# EAGLE design domeBase (EAGLE 7.4.0)
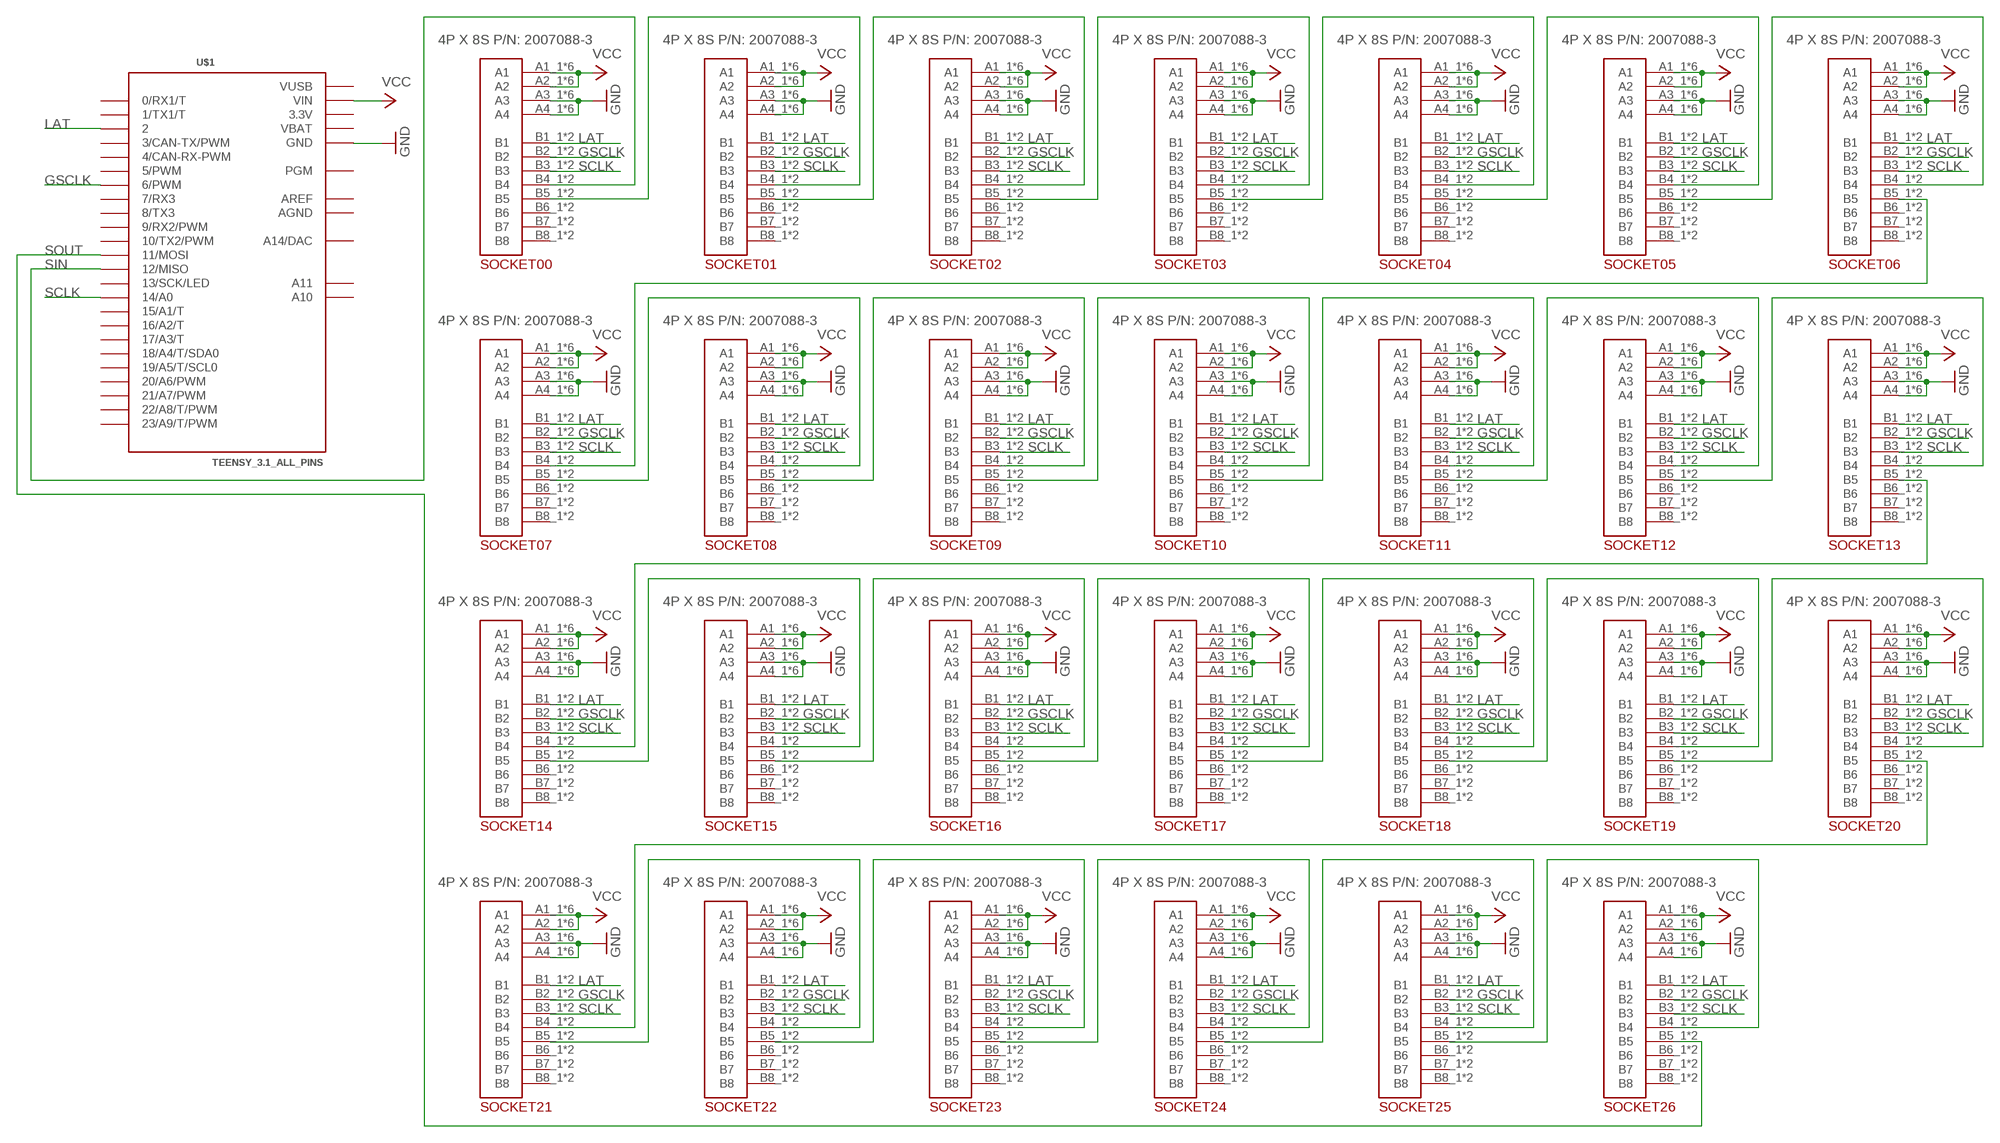
[diagram p0: schematic, sheet 1]

## Parts
SOCKET00  4POWER_8SIGNALMOUNTING_BOARD  [4POWER_8SIGNAL_MOUNT]
SOCKET01  4POWER_8SIGNALMOUNTING_BOARD  [4POWER_8SIGNAL_MOUNT]
SOCKET02  4POWER_8SIGNALMOUNTING_BOARD  [4POWER_8SIGNAL_MOUNT]
SOCKET03  4POWER_8SIGNALMOUNTING_BOARD  [4POWER_8SIGNAL_MOUNT]
SOCKET04  4POWER_8SIGNALMOUNTING_BOARD  [4POWER_8SIGNAL_MOUNT]
SOCKET05  4POWER_8SIGNALMOUNTING_BOARD  [4POWER_8SIGNAL_MOUNT]
SOCKET06  4POWER_8SIGNALMOUNTING_BOARD  [4POWER_8SIGNAL_MOUNT]
SOCKET07  4POWER_8SIGNALMOUNTING_BOARD  [4POWER_8SIGNAL_MOUNT]
SOCKET08  4POWER_8SIGNALMOUNTING_BOARD  [4POWER_8SIGNAL_MOUNT]
SOCKET09  4POWER_8SIGNALMOUNTING_BOARD  [4POWER_8SIGNAL_MOUNT]
SOCKET10  4POWER_8SIGNALMOUNTING_BOARD  [4POWER_8SIGNAL_MOUNT]
SOCKET11  4POWER_8SIGNALMOUNTING_BOARD  [4POWER_8SIGNAL_MOUNT]
SOCKET12  4POWER_8SIGNALMOUNTING_BOARD  [4POWER_8SIGNAL_MOUNT]
SOCKET13  4POWER_8SIGNALMOUNTING_BOARD  [4POWER_8SIGNAL_MOUNT]
SOCKET14  4POWER_8SIGNALMOUNTING_BOARD  [4POWER_8SIGNAL_MOUNT]
SOCKET15  4POWER_8SIGNALMOUNTING_BOARD  [4POWER_8SIGNAL_MOUNT]
SOCKET16  4POWER_8SIGNALMOUNTING_BOARD  [4POWER_8SIGNAL_MOUNT]
SOCKET17  4POWER_8SIGNALMOUNTING_BOARD  [4POWER_8SIGNAL_MOUNT]
SOCKET18  4POWER_8SIGNALMOUNTING_BOARD  [4POWER_8SIGNAL_MOUNT]
SOCKET19  4POWER_8SIGNALMOUNTING_BOARD  [4POWER_8SIGNAL_MOUNT]
SOCKET20  4POWER_8SIGNALMOUNTING_BOARD  [4POWER_8SIGNAL_MOUNT]
SOCKET21  4POWER_8SIGNALMOUNTING_BOARD  [4POWER_8SIGNAL_MOUNT]
SOCKET22  4POWER_8SIGNALMOUNTING_BOARD  [4POWER_8SIGNAL_MOUNT]
SOCKET23  4POWER_8SIGNALMOUNTING_BOARD  [4POWER_8SIGNAL_MOUNT]
SOCKET24  4POWER_8SIGNALMOUNTING_BOARD  [4POWER_8SIGNAL_MOUNT]
SOCKET25  4POWER_8SIGNALMOUNTING_BOARD  [4POWER_8SIGNAL_MOUNT]
SOCKET26  4POWER_8SIGNALMOUNTING_BOARD  [4POWER_8SIGNAL_MOUNT]
U$1  TEENSY_3.1_ALL_PINS  [TEENSY3-ALL_PINS]

## Nets
GND: SOCKET00.A3_1(A3) SOCKET00.A3_2(A3) SOCKET00.A3_3(A3) SOCKET00.A3_4(A3) SOCKET00.A3_5(A3) SOCKET00.A3_6(A3) SOCKET00.A4_1(A4) SOCKET00.A4_2(A4) SOCKET00.A4_3(A4) SOCKET00.A4_4(A4) SOCKET00.A4_5(A4) SOCKET00.A4_6(A4) SOCKET01.A3_1(A3) SOCKET01.A3_2(A3) SOCKET01.A3_3(A3) SOCKET01.A3_4(A3) SOCKET01.A3_5(A3) SOCKET01.A3_6(A3) SOCKET01.A4_1(A4) SOCKET01.A4_2(A4) SOCKET01.A4_3(A4) SOCKET01.A4_4(A4) SOCKET01.A4_5(A4) SOCKET01.A4_6(A4) SOCKET02.A3_1(A3) SOCKET02.A3_2(A3) SOCKET02.A3_3(A3) SOCKET02.A3_4(A3) SOCKET02.A3_5(A3) SOCKET02.A3_6(A3) SOCKET02.A4_1(A4) SOCKET02.A4_2(A4) SOCKET02.A4_3(A4) SOCKET02.A4_4(A4) SOCKET02.A4_5(A4) SOCKET02.A4_6(A4) SOCKET03.A3_1(A3) SOCKET03.A3_2(A3) SOCKET03.A3_3(A3) SOCKET03.A3_4(A3) SOCKET03.A3_5(A3) SOCKET03.A3_6(A3) SOCKET03.A4_1(A4) SOCKET03.A4_2(A4) SOCKET03.A4_3(A4) SOCKET03.A4_4(A4) SOCKET03.A4_5(A4) SOCKET03.A4_6(A4) SOCKET04.A3_1(A3) SOCKET04.A3_2(A3) SOCKET04.A3_3(A3) SOCKET04.A3_4(A3) SOCKET04.A3_5(A3) SOCKET04.A3_6(A3) SOCKET04.A4_1(A4) SOCKET04.A4_2(A4) SOCKET04.A4_3(A4) SOCKET04.A4_4(A4) SOCKET04.A4_5(A4) SOCKET04.A4_6(A4) SOCKET05.A3_1(A3) SOCKET05.A3_2(A3) SOCKET05.A3_3(A3) SOCKET05.A3_4(A3) SOCKET05.A3_5(A3) SOCKET05.A3_6(A3) SOCKET05.A4_1(A4) SOCKET05.A4_2(A4) SOCKET05.A4_3(A4) SOCKET05.A4_4(A4) SOCKET05.A4_5(A4) SOCKET05.A4_6(A4) SOCKET06.A3_1(A3) SOCKET06.A3_2(A3) SOCKET06.A3_3(A3) SOCKET06.A3_4(A3) SOCKET06.A3_5(A3) SOCKET06.A3_6(A3) SOCKET06.A4_1(A4) SOCKET06.A4_2(A4) SOCKET06.A4_3(A4) SOCKET06.A4_4(A4) SOCKET06.A4_5(A4) SOCKET06.A4_6(A4) SOCKET07.A3_1(A3) SOCKET07.A3_2(A3) SOCKET07.A3_3(A3) SOCKET07.A3_4(A3) SOCKET07.A3_5(A3) SOCKET07.A3_6(A3) SOCKET07.A4_1(A4) SOCKET07.A4_2(A4) SOCKET07.A4_3(A4) SOCKET07.A4_4(A4) SOCKET07.A4_5(A4) SOCKET07.A4_6(A4) SOCKET08.A3_1(A3) SOCKET08.A3_2(A3) SOCKET08.A3_3(A3) SOCKET08.A3_4(A3) SOCKET08.A3_5(A3) SOCKET08.A3_6(A3) SOCKET08.A4_1(A4) SOCKET08.A4_2(A4) SOCKET08.A4_3(A4) SOCKET08.A4_4(A4) SOCKET08.A4_5(A4) SOCKET08.A4_6(A4) SOCKET09.A3_1(A3) SOCKET09.A3_2(A3) SOCKET09.A3_3(A3) SOCKET09.A3_4(A3) SOCKET09.A3_5(A3) SOCKET09.A3_6(A3) SOCKET09.A4_1(A4) SOCKET09.A4_2(A4) SOCKET09.A4_3(A4) SOCKET09.A4_4(A4) SOCKET09.A4_5(A4) SOCKET09.A4_6(A4) SOCKET10.A3_1(A3) SOCKET10.A3_2(A3) SOCKET10.A3_3(A3) SOCKET10.A3_4(A3) SOCKET10.A3_5(A3) SOCKET10.A3_6(A3) SOCKET10.A4_1(A4) SOCKET10.A4_2(A4) SOCKET10.A4_3(A4) SOCKET10.A4_4(A4) SOCKET10.A4_5(A4) SOCKET10.A4_6(A4) SOCKET11.A3_1(A3) SOCKET11.A3_2(A3) SOCKET11.A3_3(A3) SOCKET11.A3_4(A3) SOCKET11.A3_5(A3) SOCKET11.A3_6(A3) SOCKET11.A4_1(A4) SOCKET11.A4_2(A4) SOCKET11.A4_3(A4) SOCKET11.A4_4(A4) SOCKET11.A4_5(A4) SOCKET11.A4_6(A4) SOCKET12.A3_1(A3) SOCKET12.A3_2(A3) SOCKET12.A3_3(A3) SOCKET12.A3_4(A3) SOCKET12.A3_5(A3) SOCKET12.A3_6(A3) SOCKET12.A4_1(A4) SOCKET12.A4_2(A4) SOCKET12.A4_3(A4) SOCKET12.A4_4(A4) SOCKET12.A4_5(A4) SOCKET12.A4_6(A4) SOCKET13.A3_1(A3) SOCKET13.A3_2(A3) SOCKET13.A3_3(A3) SOCKET13.A3_4(A3) SOCKET13.A3_5(A3) SOCKET13.A3_6(A3) SOCKET13.A4_1(A4) SOCKET13.A4_2(A4) SOCKET13.A4_3(A4) SOCKET13.A4_4(A4) SOCKET13.A4_5(A4) SOCKET13.A4_6(A4) SOCKET14.A3_1(A3) SOCKET14.A3_2(A3) SOCKET14.A3_3(A3) SOCKET14.A3_4(A3) SOCKET14.A3_5(A3) SOCKET14.A3_6(A3) SOCKET14.A4_1(A4) SOCKET14.A4_2(A4) SOCKET14.A4_3(A4) SOCKET14.A4_4(A4) SOCKET14.A4_5(A4) SOCKET14.A4_6(A4) SOCKET15.A3_1(A3) SOCKET15.A3_2(A3) SOCKET15.A3_3(A3) SOCKET15.A3_4(A3) SOCKET15.A3_5(A3) SOCKET15.A3_6(A3) SOCKET15.A4_1(A4) SOCKET15.A4_2(A4) SOCKET15.A4_3(A4) SOCKET15.A4_4(A4) SOCKET15.A4_5(A4) SOCKET15.A4_6(A4) SOCKET16.A3_1(A3) SOCKET16.A3_2(A3) SOCKET16.A3_3(A3) SOCKET16.A3_4(A3) SOCKET16.A3_5(A3) SOCKET16.A3_6(A3) SOCKET16.A4_1(A4) SOCKET16.A4_2(A4) SOCKET16.A4_3(A4) SOCKET16.A4_4(A4) SOCKET16.A4_5(A4) SOCKET16.A4_6(A4) SOCKET17.A3_1(A3) SOCKET17.A3_2(A3) SOCKET17.A3_3(A3) SOCKET17.A3_4(A3) SOCKET17.A3_5(A3) SOCKET17.A3_6(A3) SOCKET17.A4_1(A4) SOCKET17.A4_2(A4) SOCKET17.A4_3(A4) SOCKET17.A4_4(A4) SOCKET17.A4_5(A4) SOCKET17.A4_6(A4) SOCKET18.A3_1(A3) SOCKET18.A3_2(A3) SOCKET18.A3_3(A3) SOCKET18.A3_4(A3) SOCKET18.A3_5(A3) SOCKET18.A3_6(A3) SOCKET18.A4_1(A4) SOCKET18.A4_2(A4) SOCKET18.A4_3(A4) SOCKET18.A4_4(A4) SOCKET18.A4_5(A4) SOCKET18.A4_6(A4) SOCKET19.A3_1(A3) SOCKET19.A3_2(A3) SOCKET19.A3_3(A3) SOCKET19.A3_4(A3) SOCKET19.A3_5(A3) SOCKET19.A3_6(A3) SOCKET19.A4_1(A4) SOCKET19.A4_2(A4) SOCKET19.A4_3(A4) SOCKET19.A4_4(A4) SOCKET19.A4_5(A4) SOCKET19.A4_6(A4) SOCKET20.A3_1(A3) SOCKET20.A3_2(A3) SOCKET20.A3_3(A3) SOCKET20.A3_4(A3) SOCKET20.A3_5(A3) SOCKET20.A3_6(A3) SOCKET20.A4_1(A4) SOCKET20.A4_2(A4) SOCKET20.A4_3(A4) SOCKET20.A4_4(A4) SOCKET20.A4_5(A4) SOCKET20.A4_6(A4) SOCKET21.A3_1(A3) SOCKET21.A3_2(A3) SOCKET21.A3_3(A3) SOCKET21.A3_4(A3) SOCKET21.A3_5(A3) SOCKET21.A3_6(A3) SOCKET21.A4_1(A4) SOCKET21.A4_2(A4) SOCKET21.A4_3(A4) SOCKET21.A4_4(A4) SOCKET21.A4_5(A4) SOCKET21.A4_6(A4) SOCKET22.A3_1(A3) SOCKET22.A3_2(A3) SOCKET22.A3_3(A3) SOCKET22.A3_4(A3) SOCKET22.A3_5(A3) SOCKET22.A3_6(A3) SOCKET22.A4_1(A4) SOCKET22.A4_2(A4) SOCKET22.A4_3(A4) SOCKET22.A4_4(A4) SOCKET22.A4_5(A4) SOCKET22.A4_6(A4) SOCKET23.A3_1(A3) SOCKET23.A3_2(A3) SOCKET23.A3_3(A3) SOCKET23.A3_4(A3) SOCKET23.A3_5(A3) SOCKET23.A3_6(A3) SOCKET23.A4_1(A4) SOCKET23.A4_2(A4) SOCKET23.A4_3(A4) SOCKET23.A4_4(A4) SOCKET23.A4_5(A4) SOCKET23.A4_6(A4) SOCKET24.A3_1(A3) SOCKET24.A3_2(A3) SOCKET24.A3_3(A3) SOCKET24.A3_4(A3) SOCKET24.A3_5(A3) SOCKET24.A3_6(A3) SOCKET24.A4_1(A4) SOCKET24.A4_2(A4) SOCKET24.A4_3(A4) SOCKET24.A4_4(A4) SOCKET24.A4_5(A4) SOCKET24.A4_6(A4) SOCKET25.A3_1(A3) SOCKET25.A3_2(A3) SOCKET25.A3_3(A3) SOCKET25.A3_4(A3) SOCKET25.A3_5(A3) SOCKET25.A3_6(A3) SOCKET25.A4_1(A4) SOCKET25.A4_2(A4) SOCKET25.A4_3(A4) SOCKET25.A4_4(A4) SOCKET25.A4_5(A4) SOCKET25.A4_6(A4) SOCKET26.A3_1(A3) SOCKET26.A3_2(A3) SOCKET26.A3_3(A3) SOCKET26.A3_4(A3) SOCKET26.A3_5(A3) SOCKET26.A3_6(A3) SOCKET26.A4_1(A4) SOCKET26.A4_2(A4) SOCKET26.A4_3(A4) SOCKET26.A4_4(A4) SOCKET26.A4_5(A4) SOCKET26.A4_6(A4) U$1.GND U$1.GND1(GND)
GSCLK: SOCKET00.B2_1(B2) SOCKET00.B2_2(B2) SOCKET01.B2_1(B2) SOCKET01.B2_2(B2) SOCKET02.B2_1(B2) SOCKET02.B2_2(B2) SOCKET03.B2_1(B2) SOCKET03.B2_2(B2) SOCKET04.B2_1(B2) SOCKET04.B2_2(B2) SOCKET05.B2_1(B2) SOCKET05.B2_2(B2) SOCKET06.B2_1(B2) SOCKET06.B2_2(B2) SOCKET07.B2_1(B2) SOCKET07.B2_2(B2) SOCKET08.B2_1(B2) SOCKET08.B2_2(B2) SOCKET09.B2_1(B2) SOCKET09.B2_2(B2) SOCKET10.B2_1(B2) SOCKET10.B2_2(B2) SOCKET11.B2_1(B2) SOCKET11.B2_2(B2) SOCKET12.B2_1(B2) SOCKET12.B2_2(B2) SOCKET13.B2_1(B2) SOCKET13.B2_2(B2) SOCKET14.B2_1(B2) SOCKET14.B2_2(B2) SOCKET15.B2_1(B2) SOCKET15.B2_2(B2) SOCKET16.B2_1(B2) SOCKET16.B2_2(B2) SOCKET17.B2_1(B2) SOCKET17.B2_2(B2) SOCKET18.B2_1(B2) SOCKET18.B2_2(B2) SOCKET19.B2_1(B2) SOCKET19.B2_2(B2) SOCKET20.B2_1(B2) SOCKET20.B2_2(B2) SOCKET21.B2_1(B2) SOCKET21.B2_2(B2) SOCKET22.B2_1(B2) SOCKET22.B2_2(B2) SOCKET23.B2_1(B2) SOCKET23.B2_2(B2) SOCKET24.B2_1(B2) SOCKET24.B2_2(B2) SOCKET25.B2_1(B2) SOCKET25.B2_2(B2) SOCKET26.B2_1(B2) SOCKET26.B2_2(B2) U$1.6(6/PWM)
LAT: SOCKET00.B1_1(B1) SOCKET00.B1_2(B1) SOCKET01.B1_1(B1) SOCKET01.B1_2(B1) SOCKET02.B1_1(B1) SOCKET02.B1_2(B1) SOCKET03.B1_1(B1) SOCKET03.B1_2(B1) SOCKET04.B1_1(B1) SOCKET04.B1_2(B1) SOCKET05.B1_1(B1) SOCKET05.B1_2(B1) SOCKET06.B1_1(B1) SOCKET06.B1_2(B1) SOCKET07.B1_1(B1) SOCKET07.B1_2(B1) SOCKET08.B1_1(B1) SOCKET08.B1_2(B1) SOCKET09.B1_1(B1) SOCKET09.B1_2(B1) SOCKET10.B1_1(B1) SOCKET10.B1_2(B1) SOCKET11.B1_1(B1) SOCKET11.B1_2(B1) SOCKET12.B1_1(B1) SOCKET12.B1_2(B1) SOCKET13.B1_1(B1) SOCKET13.B1_2(B1) SOCKET14.B1_1(B1) SOCKET14.B1_2(B1) SOCKET15.B1_1(B1) SOCKET15.B1_2(B1) SOCKET16.B1_1(B1) SOCKET16.B1_2(B1) SOCKET17.B1_1(B1) SOCKET17.B1_2(B1) SOCKET18.B1_1(B1) SOCKET18.B1_2(B1) SOCKET19.B1_1(B1) SOCKET19.B1_2(B1) SOCKET20.B1_1(B1) SOCKET20.B1_2(B1) SOCKET21.B1_1(B1) SOCKET21.B1_2(B1) SOCKET22.B1_1(B1) SOCKET22.B1_2(B1) SOCKET23.B1_1(B1) SOCKET23.B1_2(B1) SOCKET24.B1_1(B1) SOCKET24.B1_2(B1) SOCKET25.B1_1(B1) SOCKET25.B1_2(B1) SOCKET26.B1_1(B1) SOCKET26.B1_2(B1) U$1.2
N$1: SOCKET00.B5_1(B5) SOCKET00.B5_2(B5) SOCKET01.B4_1(B4) SOCKET01.B4_2(B4)
N$2: SOCKET01.B5_1(B5) SOCKET01.B5_2(B5) SOCKET02.B4_1(B4) SOCKET02.B4_2(B4)
N$3: SOCKET02.B5_1(B5) SOCKET02.B5_2(B5) SOCKET03.B4_1(B4) SOCKET03.B4_2(B4)
N$4: SOCKET03.B5_1(B5) SOCKET03.B5_2(B5) SOCKET04.B4_1(B4) SOCKET04.B4_2(B4)
N$5: SOCKET04.B5_1(B5) SOCKET04.B5_2(B5) SOCKET05.B4_1(B4) SOCKET05.B4_2(B4)
N$6: SOCKET05.B5_1(B5) SOCKET05.B5_2(B5) SOCKET06.B4_1(B4) SOCKET06.B4_2(B4)
N$7: SOCKET06.B5_1(B5) SOCKET06.B5_2(B5) SOCKET07.B4_1(B4) SOCKET07.B4_2(B4)
N$8: SOCKET07.B5_1(B5) SOCKET07.B5_2(B5) SOCKET08.B4_1(B4) SOCKET08.B4_2(B4)
N$9: SOCKET08.B5_1(B5) SOCKET08.B5_2(B5) SOCKET09.B4_1(B4) SOCKET09.B4_2(B4)
N$10: SOCKET09.B5_1(B5) SOCKET09.B5_2(B5) SOCKET10.B4_1(B4) SOCKET10.B4_2(B4)
N$11: SOCKET10.B5_1(B5) SOCKET10.B5_2(B5) SOCKET11.B4_1(B4) SOCKET11.B4_2(B4)
N$12: SOCKET11.B5_1(B5) SOCKET11.B5_2(B5) SOCKET12.B4_1(B4) SOCKET12.B4_2(B4)
N$13: SOCKET12.B5_1(B5) SOCKET12.B5_2(B5) SOCKET13.B4_1(B4) SOCKET13.B4_2(B4)
N$14: SOCKET13.B5_1(B5) SOCKET13.B5_2(B5) SOCKET14.B4_1(B4) SOCKET14.B4_2(B4)
N$15: SOCKET14.B5_1(B5) SOCKET14.B5_2(B5) SOCKET15.B4_1(B4) SOCKET15.B4_2(B4)
N$16: SOCKET15.B5_1(B5) SOCKET15.B5_2(B5) SOCKET16.B4_1(B4) SOCKET16.B4_2(B4)
N$17: SOCKET16.B5_1(B5) SOCKET16.B5_2(B5) SOCKET17.B4_1(B4) SOCKET17.B4_2(B4)
N$18: SOCKET17.B5_1(B5) SOCKET17.B5_2(B5) SOCKET18.B4_1(B4) SOCKET18.B4_2(B4)
N$19: SOCKET18.B5_1(B5) SOCKET18.B5_2(B5) SOCKET19.B4_1(B4) SOCKET19.B4_2(B4)
N$20: SOCKET19.B5_1(B5) SOCKET19.B5_2(B5) SOCKET20.B4_1(B4) SOCKET20.B4_2(B4)
N$21: SOCKET20.B5_1(B5) SOCKET20.B5_2(B5) SOCKET21.B4_1(B4) SOCKET21.B4_2(B4)
N$22: SOCKET21.B5_1(B5) SOCKET21.B5_2(B5) SOCKET22.B4_1(B4) SOCKET22.B4_2(B4)
N$23: SOCKET22.B5_1(B5) SOCKET22.B5_2(B5) SOCKET23.B4_1(B4) SOCKET23.B4_2(B4)
N$24: SOCKET23.B5_1(B5) SOCKET23.B5_2(B5) SOCKET24.B4_1(B4) SOCKET24.B4_2(B4)
N$25: SOCKET24.B5_1(B5) SOCKET24.B5_2(B5) SOCKET25.B4_1(B4) SOCKET25.B4_2(B4)
N$26: SOCKET25.B5_1(B5) SOCKET25.B5_2(B5) SOCKET26.B4_1(B4) SOCKET26.B4_2(B4)
SCLK: SOCKET00.B3_1(B3) SOCKET00.B3_2(B3) SOCKET01.B3_1(B3) SOCKET01.B3_2(B3) SOCKET02.B3_1(B3) SOCKET02.B3_2(B3) SOCKET03.B3_1(B3) SOCKET03.B3_2(B3) SOCKET04.B3_1(B3) SOCKET04.B3_2(B3) SOCKET05.B3_1(B3) SOCKET05.B3_2(B3) SOCKET06.B3_1(B3) SOCKET06.B3_2(B3) SOCKET07.B3_1(B3) SOCKET07.B3_2(B3) SOCKET08.B3_1(B3) SOCKET08.B3_2(B3) SOCKET09.B3_1(B3) SOCKET09.B3_2(B3) SOCKET10.B3_1(B3) SOCKET10.B3_2(B3) SOCKET11.B3_1(B3) SOCKET11.B3_2(B3) SOCKET12.B3_1(B3) SOCKET12.B3_2(B3) SOCKET13.B3_1(B3) SOCKET13.B3_2(B3) SOCKET14.B3_1(B3) SOCKET14.B3_2(B3) SOCKET15.B3_1(B3) SOCKET15.B3_2(B3) SOCKET16.B3_1(B3) SOCKET16.B3_2(B3) SOCKET17.B3_1(B3) SOCKET17.B3_2(B3) SOCKET18.B3_1(B3) SOCKET18.B3_2(B3) SOCKET19.B3_1(B3) SOCKET19.B3_2(B3) SOCKET20.B3_1(B3) SOCKET20.B3_2(B3) SOCKET21.B3_1(B3) SOCKET21.B3_2(B3) SOCKET22.B3_1(B3) SOCKET22.B3_2(B3) SOCKET23.B3_1(B3) SOCKET23.B3_2(B3) SOCKET24.B3_1(B3) SOCKET24.B3_2(B3) SOCKET25.B3_1(B3) SOCKET25.B3_2(B3) SOCKET26.B3_1(B3) SOCKET26.B3_2(B3) U$1.14/A0
SIN: SOCKET00.B4_1(B4) SOCKET00.B4_2(B4) U$1.12(12/MISO)
SOUT: SOCKET26.B5_1(B5) SOCKET26.B5_2(B5) U$1.11(11/MOSI)
VCC: SOCKET00.A1_1(A1) SOCKET00.A1_2(A1) SOCKET00.A1_3(A1) SOCKET00.A1_4(A1) SOCKET00.A1_5(A1) SOCKET00.A1_6(A1) SOCKET00.A2_1(A2) SOCKET00.A2_2(A2) SOCKET00.A2_3(A2) SOCKET00.A2_4(A2) SOCKET00.A2_5(A2) SOCKET00.A2_6(A2) SOCKET01.A1_1(A1) SOCKET01.A1_2(A1) SOCKET01.A1_3(A1) SOCKET01.A1_4(A1) SOCKET01.A1_5(A1) SOCKET01.A1_6(A1) SOCKET01.A2_1(A2) SOCKET01.A2_2(A2) SOCKET01.A2_3(A2) SOCKET01.A2_4(A2) SOCKET01.A2_5(A2) SOCKET01.A2_6(A2) SOCKET02.A1_1(A1) SOCKET02.A1_2(A1) SOCKET02.A1_3(A1) SOCKET02.A1_4(A1) SOCKET02.A1_5(A1) SOCKET02.A1_6(A1) SOCKET02.A2_1(A2) SOCKET02.A2_2(A2) SOCKET02.A2_3(A2) SOCKET02.A2_4(A2) SOCKET02.A2_5(A2) SOCKET02.A2_6(A2) SOCKET03.A1_1(A1) SOCKET03.A1_2(A1) SOCKET03.A1_3(A1) SOCKET03.A1_4(A1) SOCKET03.A1_5(A1) SOCKET03.A1_6(A1) SOCKET03.A2_1(A2) SOCKET03.A2_2(A2) SOCKET03.A2_3(A2) SOCKET03.A2_4(A2) SOCKET03.A2_5(A2) SOCKET03.A2_6(A2) SOCKET04.A1_1(A1) SOCKET04.A1_2(A1) SOCKET04.A1_3(A1) SOCKET04.A1_4(A1) SOCKET04.A1_5(A1) SOCKET04.A1_6(A1) SOCKET04.A2_1(A2) SOCKET04.A2_2(A2) SOCKET04.A2_3(A2) SOCKET04.A2_4(A2) SOCKET04.A2_5(A2) SOCKET04.A2_6(A2) SOCKET05.A1_1(A1) SOCKET05.A1_2(A1) SOCKET05.A1_3(A1) SOCKET05.A1_4(A1) SOCKET05.A1_5(A1) SOCKET05.A1_6(A1) SOCKET05.A2_1(A2) SOCKET05.A2_2(A2) SOCKET05.A2_3(A2) SOCKET05.A2_4(A2) SOCKET05.A2_5(A2) SOCKET05.A2_6(A2) SOCKET06.A1_1(A1) SOCKET06.A1_2(A1) SOCKET06.A1_3(A1) SOCKET06.A1_4(A1) SOCKET06.A1_5(A1) SOCKET06.A1_6(A1) SOCKET06.A2_1(A2) SOCKET06.A2_2(A2) SOCKET06.A2_3(A2) SOCKET06.A2_4(A2) SOCKET06.A2_5(A2) SOCKET06.A2_6(A2) SOCKET07.A1_1(A1) SOCKET07.A1_2(A1) SOCKET07.A1_3(A1) SOCKET07.A1_4(A1) SOCKET07.A1_5(A1) SOCKET07.A1_6(A1) SOCKET07.A2_1(A2) SOCKET07.A2_2(A2) SOCKET07.A2_3(A2) SOCKET07.A2_4(A2) SOCKET07.A2_5(A2) SOCKET07.A2_6(A2) SOCKET08.A1_1(A1) SOCKET08.A1_2(A1) SOCKET08.A1_3(A1) SOCKET08.A1_4(A1) SOCKET08.A1_5(A1) SOCKET08.A1_6(A1) SOCKET08.A2_1(A2) SOCKET08.A2_2(A2) SOCKET08.A2_3(A2) SOCKET08.A2_4(A2) SOCKET08.A2_5(A2) SOCKET08.A2_6(A2) SOCKET09.A1_1(A1) SOCKET09.A1_2(A1) SOCKET09.A1_3(A1) SOCKET09.A1_4(A1) SOCKET09.A1_5(A1) SOCKET09.A1_6(A1) SOCKET09.A2_1(A2) SOCKET09.A2_2(A2) SOCKET09.A2_3(A2) SOCKET09.A2_4(A2) SOCKET09.A2_5(A2) SOCKET09.A2_6(A2) SOCKET10.A1_1(A1) SOCKET10.A1_2(A1) SOCKET10.A1_3(A1) SOCKET10.A1_4(A1) SOCKET10.A1_5(A1) SOCKET10.A1_6(A1) SOCKET10.A2_1(A2) SOCKET10.A2_2(A2) SOCKET10.A2_3(A2) SOCKET10.A2_4(A2) SOCKET10.A2_5(A2) SOCKET10.A2_6(A2) SOCKET11.A1_1(A1) SOCKET11.A1_2(A1) SOCKET11.A1_3(A1) SOCKET11.A1_4(A1) SOCKET11.A1_5(A1) SOCKET11.A1_6(A1) SOCKET11.A2_1(A2) SOCKET11.A2_2(A2) SOCKET11.A2_3(A2) SOCKET11.A2_4(A2) SOCKET11.A2_5(A2) SOCKET11.A2_6(A2) SOCKET12.A1_1(A1) SOCKET12.A1_2(A1) SOCKET12.A1_3(A1) SOCKET12.A1_4(A1) SOCKET12.A1_5(A1) SOCKET12.A1_6(A1) SOCKET12.A2_1(A2) SOCKET12.A2_2(A2) SOCKET12.A2_3(A2) SOCKET12.A2_4(A2) SOCKET12.A2_5(A2) SOCKET12.A2_6(A2) SOCKET13.A1_1(A1) SOCKET13.A1_2(A1) SOCKET13.A1_3(A1) SOCKET13.A1_4(A1) SOCKET13.A1_5(A1) SOCKET13.A1_6(A1) SOCKET13.A2_1(A2) SOCKET13.A2_2(A2) SOCKET13.A2_3(A2) SOCKET13.A2_4(A2) SOCKET13.A2_5(A2) SOCKET13.A2_6(A2) SOCKET14.A1_1(A1) SOCKET14.A1_2(A1) SOCKET14.A1_3(A1) SOCKET14.A1_4(A1) SOCKET14.A1_5(A1) SOCKET14.A1_6(A1) SOCKET14.A2_1(A2) SOCKET14.A2_2(A2) SOCKET14.A2_3(A2) SOCKET14.A2_4(A2) SOCKET14.A2_5(A2) SOCKET14.A2_6(A2) SOCKET15.A1_1(A1) SOCKET15.A1_2(A1) SOCKET15.A1_3(A1) SOCKET15.A1_4(A1) SOCKET15.A1_5(A1) SOCKET15.A1_6(A1) SOCKET15.A2_1(A2) SOCKET15.A2_2(A2) SOCKET15.A2_3(A2) SOCKET15.A2_4(A2) SOCKET15.A2_5(A2) SOCKET15.A2_6(A2) SOCKET16.A1_1(A1) SOCKET16.A1_2(A1) SOCKET16.A1_3(A1) SOCKET16.A1_4(A1) SOCKET16.A1_5(A1) SOCKET16.A1_6(A1) SOCKET16.A2_1(A2) SOCKET16.A2_2(A2) SOCKET16.A2_3(A2) SOCKET16.A2_4(A2) SOCKET16.A2_5(A2) SOCKET16.A2_6(A2) SOCKET17.A1_1(A1) SOCKET17.A1_2(A1) SOCKET17.A1_3(A1) SOCKET17.A1_4(A1) SOCKET17.A1_5(A1) SOCKET17.A1_6(A1) SOCKET17.A2_1(A2) SOCKET17.A2_2(A2) SOCKET17.A2_3(A2) SOCKET17.A2_4(A2) SOCKET17.A2_5(A2) SOCKET17.A2_6(A2) SOCKET18.A1_1(A1) SOCKET18.A1_2(A1) SOCKET18.A1_3(A1) SOCKET18.A1_4(A1) SOCKET18.A1_5(A1) SOCKET18.A1_6(A1) SOCKET18.A2_1(A2) SOCKET18.A2_2(A2) SOCKET18.A2_3(A2) SOCKET18.A2_4(A2) SOCKET18.A2_5(A2) SOCKET18.A2_6(A2) SOCKET19.A1_1(A1) SOCKET19.A1_2(A1) SOCKET19.A1_3(A1) SOCKET19.A1_4(A1) SOCKET19.A1_5(A1) SOCKET19.A1_6(A1) SOCKET19.A2_1(A2) SOCKET19.A2_2(A2) SOCKET19.A2_3(A2) SOCKET19.A2_4(A2) SOCKET19.A2_5(A2) SOCKET19.A2_6(A2) SOCKET20.A1_1(A1) SOCKET20.A1_2(A1) SOCKET20.A1_3(A1) SOCKET20.A1_4(A1) SOCKET20.A1_5(A1) SOCKET20.A1_6(A1) SOCKET20.A2_1(A2) SOCKET20.A2_2(A2) SOCKET20.A2_3(A2) SOCKET20.A2_4(A2) SOCKET20.A2_5(A2) SOCKET20.A2_6(A2) SOCKET21.A1_1(A1) SOCKET21.A1_2(A1) SOCKET21.A1_3(A1) SOCKET21.A1_4(A1) SOCKET21.A1_5(A1) SOCKET21.A1_6(A1) SOCKET21.A2_1(A2) SOCKET21.A2_2(A2) SOCKET21.A2_3(A2) SOCKET21.A2_4(A2) SOCKET21.A2_5(A2) SOCKET21.A2_6(A2) SOCKET22.A1_1(A1) SOCKET22.A1_2(A1) SOCKET22.A1_3(A1) SOCKET22.A1_4(A1) SOCKET22.A1_5(A1) SOCKET22.A1_6(A1) SOCKET22.A2_1(A2) SOCKET22.A2_2(A2) SOCKET22.A2_3(A2) SOCKET22.A2_4(A2) SOCKET22.A2_5(A2) SOCKET22.A2_6(A2) SOCKET23.A1_1(A1) SOCKET23.A1_2(A1) SOCKET23.A1_3(A1) SOCKET23.A1_4(A1) SOCKET23.A1_5(A1) SOCKET23.A1_6(A1) SOCKET23.A2_1(A2) SOCKET23.A2_2(A2) SOCKET23.A2_3(A2) SOCKET23.A2_4(A2) SOCKET23.A2_5(A2) SOCKET23.A2_6(A2) SOCKET24.A1_1(A1) SOCKET24.A1_2(A1) SOCKET24.A1_3(A1) SOCKET24.A1_4(A1) SOCKET24.A1_5(A1) SOCKET24.A1_6(A1) SOCKET24.A2_1(A2) SOCKET24.A2_2(A2) SOCKET24.A2_3(A2) SOCKET24.A2_4(A2) SOCKET24.A2_5(A2) SOCKET24.A2_6(A2) SOCKET25.A1_1(A1) SOCKET25.A1_2(A1) SOCKET25.A1_3(A1) SOCKET25.A1_4(A1) SOCKET25.A1_5(A1) SOCKET25.A1_6(A1) SOCKET25.A2_1(A2) SOCKET25.A2_2(A2) SOCKET25.A2_3(A2) SOCKET25.A2_4(A2) SOCKET25.A2_5(A2) SOCKET25.A2_6(A2) SOCKET26.A1_1(A1) SOCKET26.A1_2(A1) SOCKET26.A1_3(A1) SOCKET26.A1_4(A1) SOCKET26.A1_5(A1) SOCKET26.A1_6(A1) SOCKET26.A2_1(A2) SOCKET26.A2_2(A2) SOCKET26.A2_3(A2) SOCKET26.A2_4(A2) SOCKET26.A2_5(A2) SOCKET26.A2_6(A2) U$1.VIN
Unconnected: SOCKET00.B6_1(B6) SOCKET00.B6_2(B6) SOCKET00.B7_1(B7) SOCKET00.B7_2(B7) SOCKET00.B8_1(B8) SOCKET00.B8_2(B8) SOCKET01.B6_1(B6) SOCKET01.B6_2(B6) SOCKET01.B7_1(B7) SOCKET01.B7_2(B7) SOCKET01.B8_1(B8) SOCKET01.B8_2(B8) SOCKET02.B6_1(B6) SOCKET02.B6_2(B6) SOCKET02.B7_1(B7) SOCKET02.B7_2(B7) SOCKET02.B8_1(B8) SOCKET02.B8_2(B8) SOCKET03.B6_1(B6) SOCKET03.B6_2(B6) SOCKET03.B7_1(B7) SOCKET03.B7_2(B7) SOCKET03.B8_1(B8) SOCKET03.B8_2(B8) SOCKET04.B6_1(B6) SOCKET04.B6_2(B6) SOCKET04.B7_1(B7) SOCKET04.B7_2(B7) SOCKET04.B8_1(B8) SOCKET04.B8_2(B8) SOCKET05.B6_1(B6) SOCKET05.B6_2(B6) SOCKET05.B7_1(B7) SOCKET05.B7_2(B7) SOCKET05.B8_1(B8) SOCKET05.B8_2(B8) SOCKET06.B6_1(B6) SOCKET06.B6_2(B6) SOCKET06.B7_1(B7) SOCKET06.B7_2(B7) SOCKET06.B8_1(B8) SOCKET06.B8_2(B8) SOCKET07.B6_1(B6) SOCKET07.B6_2(B6) SOCKET07.B7_1(B7) SOCKET07.B7_2(B7) SOCKET07.B8_1(B8) SOCKET07.B8_2(B8) SOCKET08.B6_1(B6) SOCKET08.B6_2(B6) SOCKET08.B7_1(B7) SOCKET08.B7_2(B7) SOCKET08.B8_1(B8) SOCKET08.B8_2(B8) SOCKET09.B6_1(B6) SOCKET09.B6_2(B6) SOCKET09.B7_1(B7) SOCKET09.B7_2(B7) SOCKET09.B8_1(B8) SOCKET09.B8_2(B8) SOCKET10.B6_1(B6) SOCKET10.B6_2(B6) SOCKET10.B7_1(B7) SOCKET10.B7_2(B7) SOCKET10.B8_1(B8) SOCKET10.B8_2(B8) SOCKET11.B6_1(B6) SOCKET11.B6_2(B6) SOCKET11.B7_1(B7) SOCKET11.B7_2(B7) SOCKET11.B8_1(B8) SOCKET11.B8_2(B8) SOCKET12.B6_1(B6) SOCKET12.B6_2(B6) SOCKET12.B7_1(B7) SOCKET12.B7_2(B7) SOCKET12.B8_1(B8) SOCKET12.B8_2(B8) SOCKET13.B6_1(B6) SOCKET13.B6_2(B6) SOCKET13.B7_1(B7) SOCKET13.B7_2(B7) SOCKET13.B8_1(B8) SOCKET13.B8_2(B8) SOCKET14.B6_1(B6) SOCKET14.B6_2(B6) SOCKET14.B7_1(B7) SOCKET14.B7_2(B7) SOCKET14.B8_1(B8) SOCKET14.B8_2(B8) SOCKET15.B6_1(B6) SOCKET15.B6_2(B6) SOCKET15.B7_1(B7) SOCKET15.B7_2(B7) SOCKET15.B8_1(B8) SOCKET15.B8_2(B8) SOCKET16.B6_1(B6) SOCKET16.B6_2(B6) SOCKET16.B7_1(B7) SOCKET16.B7_2(B7) SOCKET16.B8_1(B8) SOCKET16.B8_2(B8) SOCKET17.B6_1(B6) SOCKET17.B6_2(B6) SOCKET17.B7_1(B7) SOCKET17.B7_2(B7) SOCKET17.B8_1(B8) SOCKET17.B8_2(B8) SOCKET18.B6_1(B6) SOCKET18.B6_2(B6) SOCKET18.B7_1(B7) SOCKET18.B7_2(B7) SOCKET18.B8_1(B8) SOCKET18.B8_2(B8) SOCKET19.B6_1(B6) SOCKET19.B6_2(B6) SOCKET19.B7_1(B7) SOCKET19.B7_2(B7) SOCKET19.B8_1(B8) SOCKET19.B8_2(B8) SOCKET20.B6_1(B6) SOCKET20.B6_2(B6) SOCKET20.B7_1(B7) SOCKET20.B7_2(B7) SOCKET20.B8_1(B8) SOCKET20.B8_2(B8) SOCKET21.B6_1(B6) SOCKET21.B6_2(B6) SOCKET21.B7_1(B7) SOCKET21.B7_2(B7) SOCKET21.B8_1(B8) SOCKET21.B8_2(B8) SOCKET22.B6_1(B6) SOCKET22.B6_2(B6) SOCKET22.B7_1(B7) SOCKET22.B7_2(B7) SOCKET22.B8_1(B8) SOCKET22.B8_2(B8) SOCKET23.B6_1(B6) SOCKET23.B6_2(B6) SOCKET23.B7_1(B7) SOCKET23.B7_2(B7) SOCKET23.B8_1(B8) SOCKET23.B8_2(B8) SOCKET24.B6_1(B6) SOCKET24.B6_2(B6) SOCKET24.B7_1(B7) SOCKET24.B7_2(B7) SOCKET24.B8_1(B8) SOCKET24.B8_2(B8) SOCKET25.B6_1(B6) SOCKET25.B6_2(B6) SOCKET25.B7_1(B7) SOCKET25.B7_2(B7) SOCKET25.B8_1(B8) SOCKET25.B8_2(B8) SOCKET26.B6_1(B6) SOCKET26.B6_2(B6) SOCKET26.B7_1(B7) SOCKET26.B7_2(B7) SOCKET26.B8_1(B8) SOCKET26.B8_2(B8) U$1.0(0/RX1/T) U$1.1(1/TX1/T) U$1.3(3/CAN-TX/PWM) U$1.4(4/CAN-RX-PWM) U$1.5(5/PWM) U$1.7(7/RX3) U$1.8(8/TX3) U$1.9(9/RX2/PWM) U$1.10(10/TX2/PWM) U$1.13(13/SCK/LED) U$1.15/A1(15/A1/T) U$1.16/A2(16/A2/T) U$1.17/A3(17/A3/T) U$1.18/A4(18/A4/T/SDA0) U$1.19/A5(19/A5/T/SCL0) U$1.20/A6(20/A6/PWM) U$1.21/A7(21/A7/PWM) U$1.22/A8(22/A8/T/PWM) U$1.23/A9(23/A9/T/PWM) U$1.A10 U$1.A11 U$1.PGM U$1.RESET/DAC(A14/DAC)

## Power pins joined to a net without a drawn wire
3.3V: U$1.3.3V U$1.3.3V1(3.3V)
AGND: U$1.AGND
AREF: U$1.AREF
VBAT: U$1.VBAT
VUSB: U$1.VUSB

## Library data of the parts
SOCKET00 SOCKET01-SOCKET09 SOCKET10-SOCKET26 = WallerLabLib:4POWER_8SIGNAL
U$1 = Teensy_3_and_LC_Series_Boards_v1.1:TEENSY_3.1_ALL_PINS: Footprint for Teensy 3.1 or 3.2 board using all through-holes, i.e. the entire perimeter plus the 4 through-holes inboard (A10,A11,AREF, VUSB)

## Board
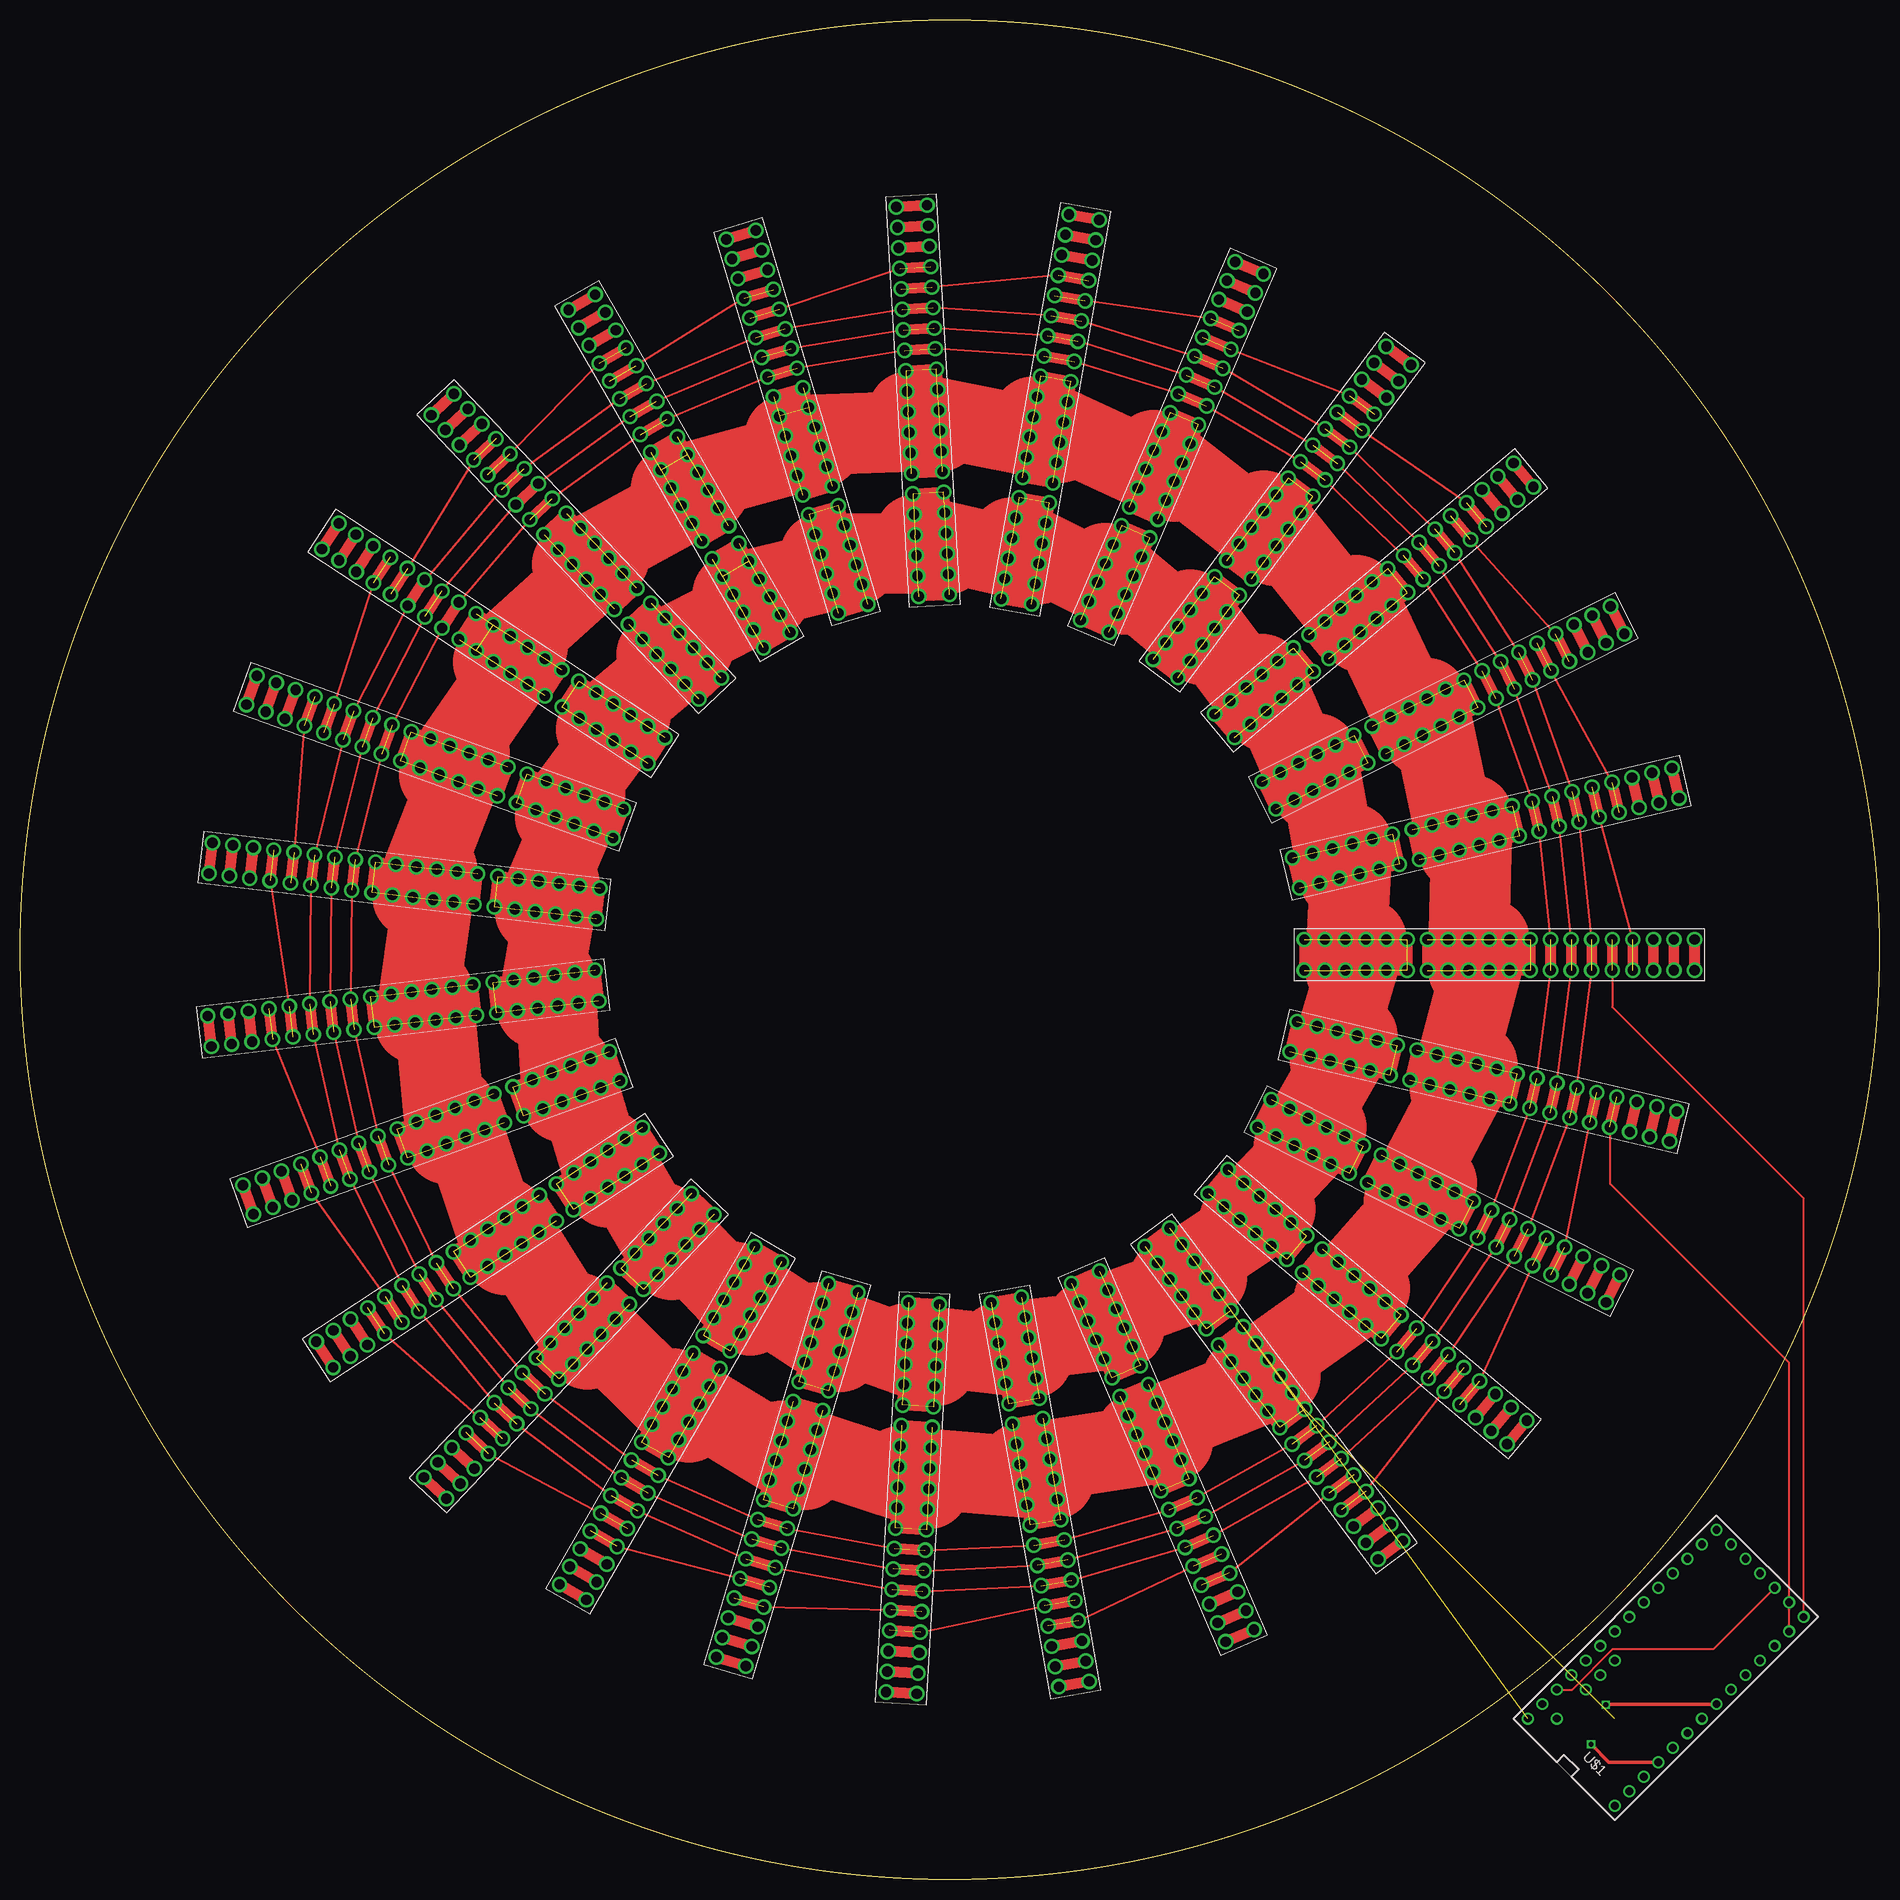
[diagram p1: board, top side]
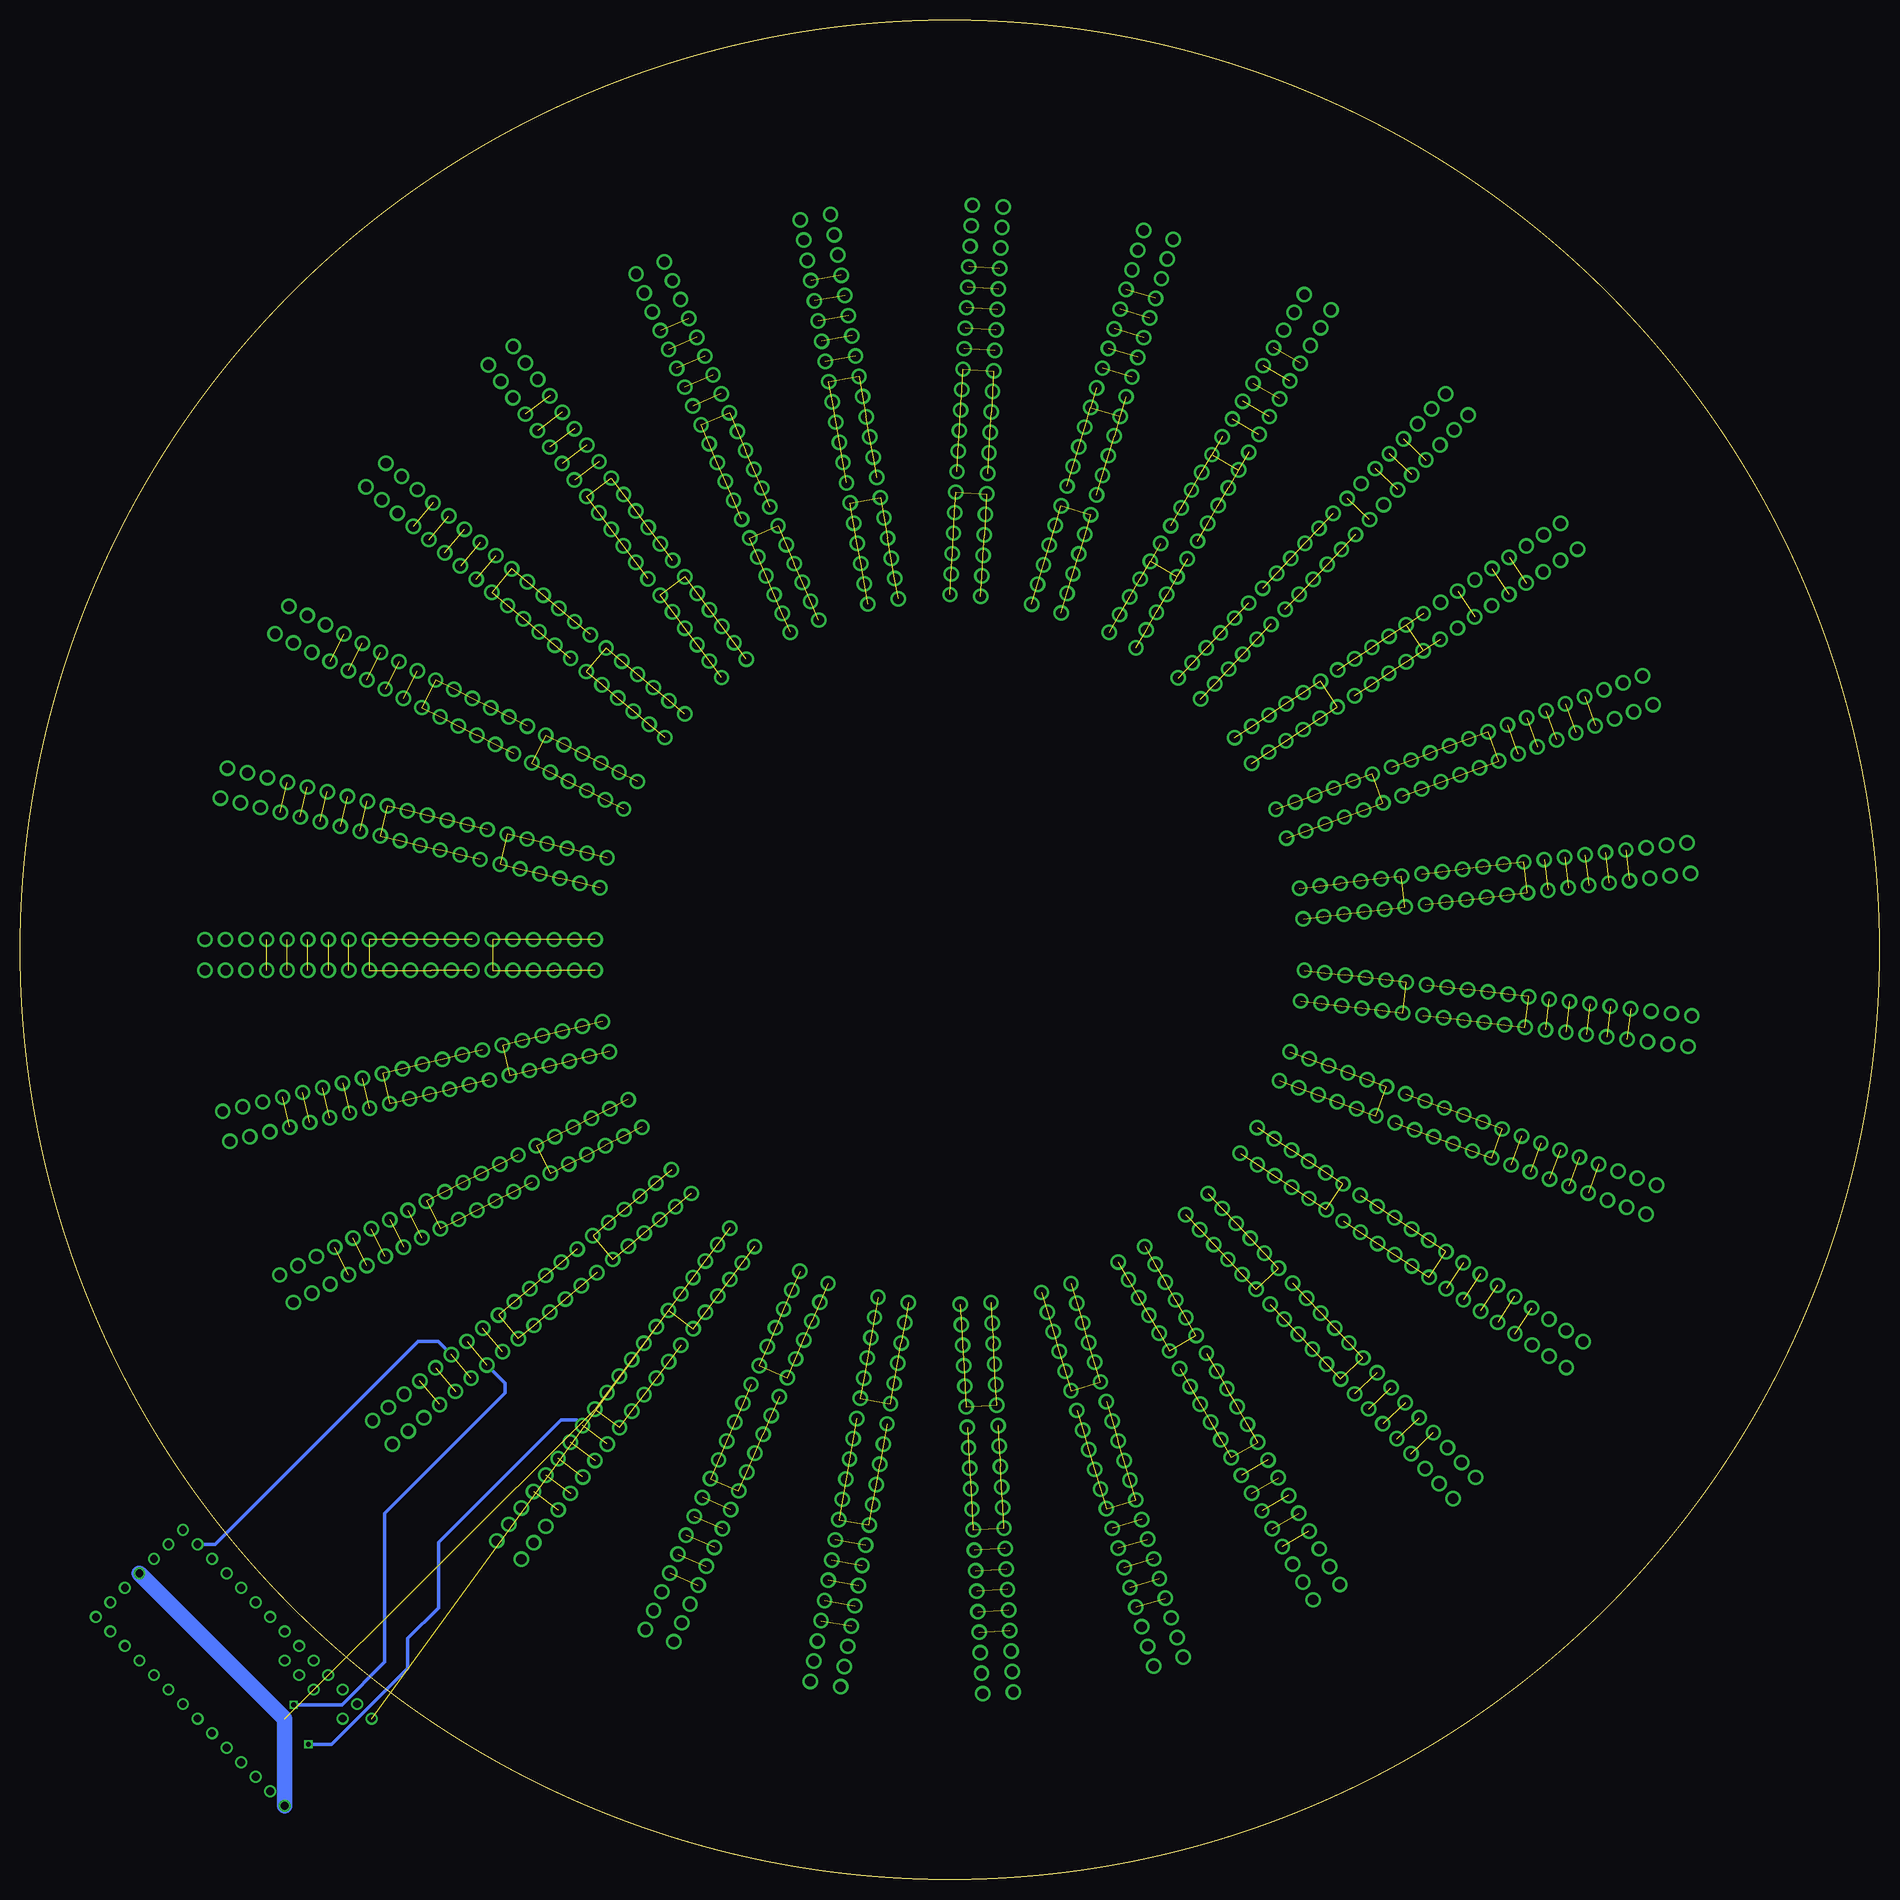
[diagram p2: board, bottom side, seen from below]

Size 230 x 230 mm. Coordinates in mm from the lower left corner, seen from the top.
Outline: circle at 115,115 radius 115
Copper layers (1*16): Top 0.035mm / dielectric 1.5mm / Bottom 0.035mm
Design rules "default": minimum track width 10mil, minimum drill 24mil, track to track 8mil, track to pad 8mil, pad to pad 8mil, via to via 8mil, smd to smd 8mil, copper to edge 40mil, drill to drill 8mil, minimum pad ring 10mil, minimum via ring 8mil, stop-mask expansion 4mil, vias tented up to drill 0mil, thermal gap 10mil

### Footprints (pad centres in the part's own frame; a part is rotated, then mirrored left to right if it is on the bottom)
4POWER_8SIGNAL_MOUNT = drill 1.27: A1_1 -24.13,1.27; A1_2 -21.59,1.27; A1_3 -19.05,1.27; A1_4 -24.13,-2.54; A1_5 -21.59,-2.54; A1_6 -19.05,-2.54; A2_1 -16.51,1.27; A2_2 -13.97,1.27; A2_3 -11.43,1.27; A2_4 -16.51,-2.54; A2_5 -13.97,-2.54; A2_6 -11.43,-2.54; A3_1 -8.89,1.27; A3_2 -6.35,1.27; A3_3 -3.81,1.27; A3_4 -8.89,-2.54; A3_5 -6.35,-2.54; A3_6 -3.81,-2.54; A4_1 -1.27,1.27; A4_2 1.27,1.27; A4_3 3.81,1.27; A4_4 -1.27,-2.54; A4_5 1.27,-2.54; A4_6 3.81,-2.54; B1_1 6.35,1.27; B1_2 6.35,-2.54; B2_1 8.89,1.27; B2_2 8.89,-2.54; B3_1 11.43,1.27; B3_2 11.43,-2.54; B4_1 13.97,1.27; B4_2 13.97,-2.54; B5_1 16.51,1.27; B5_2 16.51,-2.54; B6_1 19.05,1.27; B6_2 19.05,-2.54; B7_1 21.59,1.27; B7_2 21.59,-2.54; B8_1 24.13,1.27; B8_2 24.13,-2.54
TEENSY3-ALL_PINS = drill 0.965: 0 -7.62,13.97; 1 -7.62,11.43; 2 -7.62,8.89; 3 -7.62,6.35; 3.3V 7.62,11.43; 3.3V1 -2.54,-16.51; 4 -7.62,3.81; 5 -7.62,1.27; 6 -7.62,-1.27; 7 -7.62,-3.81; 8 -7.62,-6.35; 9 -7.62,-8.89; 10 -7.62,-11.43; 11 -7.62,-13.97; 12 -7.62,-16.51; 13 7.62,-16.51; 14/A0 7.62,-13.97; 15/A1 7.62,-11.43; 16/A2 7.62,-8.89; 17/A3 7.62,-6.35; 18/A4 7.62,-3.81; 19/A5 7.62,-1.27; 20/A6 7.62,1.27; 21/A7 7.62,3.81; 22/A8 7.62,6.35; 23/A9 7.62,8.89; A10 5.08,6.35; A11 5.08,3.81; AGND 7.62,13.97; AREF 5.08,8.89; GND -7.62,16.51; GND1 0,-16.51; PGM 2.54,-16.51; RESET/DAC 5.08,-16.51; VBAT -5.08,-16.51; VIN 7.62,16.51; VUSB 5.08,13.97

### Placement (x,y rotation side)
SOCKET00  183,115 0 top
SOCKET01  181.17,130.68 13.3 top
SOCKET02  175.77,145.52 26.7 top
SOCKET03  167.09,158.71 40 top
SOCKET04  155.61,169.54 53.3 top
SOCKET05  141.93,177.44 66.7 top
SOCKET06  126.81,181.97 80 top
SOCKET07  111.05,182.88 93.3 top
SOCKET08  95.5,180.14 106.7 top
SOCKET09  81,173.89 120 top
SOCKET10  68.34,164.46 133.3 top
SOCKET11  58.19,152.37 146.7 top
SOCKET12  51.1,138.26 160 top
SOCKET13  47.46,122.89 173.3 top
SOCKET14  47.46,107.11 186.7 top
SOCKET15  51.1,91.74 200 top
SOCKET16  58.19,77.63 213.3 top
SOCKET17  68.34,65.54 226.7 top
SOCKET18  81,56.11 240 top
SOCKET19  95.5,49.86 253.3 top
SOCKET20  111.05,47.12 266.7 top
SOCKET21  126.81,48.03 280 top
SOCKET22  141.93,52.56 293.3 top
SOCKET23  155.61,60.46 306.7 top
SOCKET24  167.09,71.29 320 top
SOCKET25  175.77,84.48 333.3 top
SOCKET26  181.17,99.32 346.7 top
U$1  203.58,26.17 135 top

### Tracks (layer width: path | path; a pad name or v marks a point on that pad's centre or on a via)
3.3V
  Top 0.254: U$1.3.3V 192.02,23.47 197.05,28.5 209.5,28.5 U$1.3.3V1
GND  (297 unrouted)
  Top 10: SOCKET11.A3_6 SOCKET12.A4_1 | SOCKET12.A3_6 SOCKET13.A4_1 | SOCKET13.A3_6 SOCKET14.A4_1 | SOCKET14.A3_6 SOCKET15.A4_1 | SOCKET15.A3_6 SOCKET16.A4_1 | SOCKET16.A3_6 SOCKET17.A4_1 | SOCKET17.A3_6 SOCKET18.A4_1 | SOCKET18.A3_6 SOCKET19.A4_1 | SOCKET19.A3_6 SOCKET20.A4_1 | SOCKET20.A3_6 SOCKET21.A4_1 | SOCKET21.A3_6 SOCKET22.A4_1 | SOCKET22.A3_6 SOCKET23.A4_1 | SOCKET23.A3_6 SOCKET24.A4_1 | SOCKET24.A3_6 SOCKET25.A4_1 | SOCKET25.A3_6 SOCKET26.A4_1 | SOCKET26.A3_6 SOCKET00.A4_1 | SOCKET00.A3_6 SOCKET01.A4_1 | SOCKET01.A3_6 SOCKET02.A4_1 | SOCKET02.A3_6 SOCKET03.A4_1 | SOCKET03.A3_6 SOCKET04.A4_1 | SOCKET04.A3_6 SOCKET05.A4_1 | SOCKET05.A3_6 SOCKET06.A4_1 | SOCKET06.A3_6 SOCKET07.A4_1 | SOCKET07.A3_6 SOCKET08.A4_1 | SOCKET08.A3_6 SOCKET09.A4_1 | SOCKET09.A3_6 SOCKET10.A4_1 | SOCKET10.A3_6 SOCKET11.A4_1
  Bottom 1.93: U$1.GND 197.29,19.88 U$1.GND1
GSCLK  (via drill 0.6)  (26 unrouted)
  Top 0.254: SOCKET00.B2_1 SOCKET01.B2_2 | SOCKET01.B2_1 SOCKET02.B2_2 | SOCKET02.B2_1 SOCKET03.B2_2 | SOCKET03.B2_1 SOCKET04.B2_2 | SOCKET04.B2_1 SOCKET05.B2_2 | SOCKET05.B2_1 SOCKET06.B2_2 | SOCKET06.B2_1 SOCKET07.B2_2 | SOCKET07.B2_1 SOCKET08.B2_2 | SOCKET08.B2_1 SOCKET09.B2_2 | SOCKET09.B2_1 SOCKET10.B2_2 | SOCKET11.B2_2 SOCKET10.B2_1 | SOCKET11.B2_1 SOCKET12.B2_2 | SOCKET12.B2_1 SOCKET13.B2_2 | SOCKET13.B2_1 SOCKET14.B2_2 | SOCKET14.B2_1 SOCKET15.B2_2 | SOCKET15.B2_1 SOCKET16.B2_2 | SOCKET16.B2_1 SOCKET17.B2_2 | SOCKET17.B2_1 SOCKET18.B2_2 | SOCKET18.B2_1 SOCKET19.B2_2 | SOCKET19.B2_1 SOCKET20.B2_2 | SOCKET20.B2_1 SOCKET21.B2_2 | SOCKET21.B2_1 SOCKET22.B2_2 | SOCKET22.B2_1 SOCKET23.B2_2 | SOCKET23.B2_1 SOCKET24.B2_2 | SOCKET24.B2_1 SOCKET25.B2_2 | SOCKET25.B2_1 SOCKET26.B2_2 | SOCKET26.B2_1 SOCKET00.B2_2
  Top 0.406: U$1.6 196.23,21.68 v196.15,21.6
  Bottom 0.406: v196.15,21.6 190.2,21.6 184.9,26.9 184.9,45.25 170,60.15 170,61.36 SOCKET24.B2_2
LAT  (via drill 0.6)  (26 unrouted)
  Top 0.254: SOCKET00.B1_1 SOCKET01.B1_2 | SOCKET01.B1_1 SOCKET02.B1_2 | SOCKET02.B1_1 SOCKET03.B1_2 | SOCKET03.B1_1 SOCKET04.B1_2 | SOCKET04.B1_1 SOCKET05.B1_2 | SOCKET05.B1_1 SOCKET06.B1_2 | SOCKET06.B1_1 SOCKET07.B1_2 | SOCKET07.B1_1 SOCKET08.B1_2 | SOCKET08.B1_1 SOCKET09.B1_2 | SOCKET09.B1_1 SOCKET10.B1_2 | SOCKET11.B1_2 SOCKET10.B1_1 | SOCKET11.B1_1 SOCKET12.B1_2 | SOCKET12.B1_1 SOCKET13.B1_2 | SOCKET13.B1_1 SOCKET14.B1_2 | SOCKET14.B1_1 SOCKET15.B1_2 | SOCKET15.B1_1 SOCKET16.B1_2 | SOCKET16.B1_1 SOCKET17.B1_2 | SOCKET17.B1_1 SOCKET18.B1_2 | SOCKET18.B1_1 SOCKET19.B1_2 | SOCKET19.B1_1 SOCKET20.B1_2 | SOCKET20.B1_1 SOCKET21.B1_2 | SOCKET21.B1_1 SOCKET22.B1_2 | SOCKET22.B1_1 SOCKET23.B1_2 | SOCKET23.B1_1 SOCKET24.B1_2 | SOCKET24.B1_1 SOCKET25.B1_2 | SOCKET25.B1_1 SOCKET26.B1_2 | SOCKET26.B1_1 SOCKET00.B1_2
  Top 0.406: U$1.2 196.56,14.49 v194.35,16.7
  Bottom 0.406: SOCKET23.B1_1 161.15,56.85 163.1,56.85 178.25,41.7 178.25,33.6 182.05,29.8 182.05,26.1 191.45,16.7 v194.35,16.7
N$1  (2 unrouted)
  Top 0.254: SOCKET00.B5_1 SOCKET01.B4_2
N$2  (2 unrouted)
  Top 0.254: SOCKET01.B5_1 SOCKET02.B4_2
N$3  (2 unrouted)
  Top 0.254: SOCKET02.B5_1 SOCKET03.B4_2
N$4  (2 unrouted)
  Top 0.254: SOCKET03.B5_1 SOCKET04.B4_2
N$5  (2 unrouted)
  Top 0.254: SOCKET04.B5_1 SOCKET05.B4_2
N$6  (2 unrouted)
  Top 0.254: SOCKET05.B5_1 SOCKET06.B4_2
N$7  (2 unrouted)
  Top 0.254: SOCKET06.B5_1 SOCKET07.B4_2
N$8  (2 unrouted)
  Top 0.254: SOCKET07.B5_1 SOCKET08.B4_2
N$9  (2 unrouted)
  Top 0.254: SOCKET08.B5_1 SOCKET09.B4_2
N$10  (2 unrouted)
  Top 0.254: SOCKET09.B5_1 SOCKET10.B4_2
N$11  (2 unrouted)
  Top 0.254: SOCKET10.B5_1 SOCKET11.B4_2
N$12  (2 unrouted)
  Top 0.254: SOCKET11.B5_1 SOCKET12.B4_2
N$13  (2 unrouted)
  Top 0.254: SOCKET12.B5_1 SOCKET13.B4_2
N$14  (2 unrouted)
  Top 0.254: SOCKET13.B5_1 SOCKET14.B4_2
N$15  (2 unrouted)
  Top 0.254: SOCKET14.B5_1 SOCKET15.B4_2
N$16  (2 unrouted)
  Top 0.254: SOCKET15.B5_1 SOCKET16.B4_2
N$17  (2 unrouted)
  Top 0.254: SOCKET16.B5_1 SOCKET17.B4_2
N$18  (2 unrouted)
  Top 0.254: SOCKET17.B5_1 SOCKET18.B4_2
N$19  (2 unrouted)
  Top 0.254: SOCKET18.B5_1 SOCKET19.B4_2
N$20  (2 unrouted)
  Top 0.254: SOCKET19.B5_1 SOCKET20.B4_2
N$21  (2 unrouted)
  Top 0.254: SOCKET20.B5_1 SOCKET21.B4_2
N$22  (2 unrouted)
  Top 0.254: SOCKET21.B5_1 SOCKET22.B4_2
N$23  (2 unrouted)
  Top 0.254: SOCKET22.B5_1 SOCKET23.B4_2
N$24  (2 unrouted)
  Top 0.254: SOCKET23.B5_1 SOCKET24.B4_2
N$25  (2 unrouted)
  Top 0.254: SOCKET24.B5_1 SOCKET25.B4_2
N$26  (2 unrouted)
  Top 0.254: SOCKET25.B5_1 SOCKET26.B4_2
SCLK  (26 unrouted)
  Top 0.254: SOCKET00.B3_1 SOCKET01.B3_2 | SOCKET01.B3_1 SOCKET02.B3_2 | SOCKET02.B3_1 SOCKET03.B3_2 | SOCKET03.B3_1 SOCKET04.B3_2 | SOCKET04.B3_1 SOCKET05.B3_2 | SOCKET05.B3_1 SOCKET06.B3_2 | SOCKET06.B3_1 SOCKET07.B3_2 | SOCKET07.B3_1 SOCKET08.B3_2 | SOCKET08.B3_1 SOCKET09.B3_2 | SOCKET09.B3_1 SOCKET10.B3_2 | 59.15,171.5 SOCKET10.B3_1 50.15,160.75 SOCKET11.B3_2 | SOCKET11.B3_1 SOCKET12.B3_2 | SOCKET12.B3_1 SOCKET13.B3_2 | SOCKET13.B3_1 SOCKET14.B3_2 | SOCKET14.B3_1 SOCKET15.B3_2 | SOCKET15.B3_1 SOCKET16.B3_2 | SOCKET16.B3_1 SOCKET17.B3_2 | SOCKET17.B3_1 SOCKET18.B3_2 | SOCKET18.B3_1 SOCKET19.B3_2 | SOCKET19.B3_1 SOCKET20.B3_2 | SOCKET20.B3_1 SOCKET21.B3_2 | SOCKET21.B3_1 SOCKET22.B3_2 | SOCKET22.B3_1 SOCKET23.B3_2 | SOCKET24.B3_2 SOCKET23.B3_1 | SOCKET25.B3_2 SOCKET24.B3_1 | SOCKET25.B3_1 SOCKET26.B3_2 | SOCKET26.B3_1 SOCKET00.B3_2
  Bottom 0.406: U$1.14/A0 205.87,41.43 180.75,66.55 178.3,66.55 SOCKET24.B3_1
SIN  (1 unrouted)
  Top 0.254: U$1.12 220.64,84.21 196.95,107.9 196.97,107.92 SOCKET00.B4_2
SOUT  (1 unrouted)
  Top 0.254: U$1.11 218.84,63.86 196.7,86 196.7,93 SOCKET26.B5_2
VCC  (297 unrouted)
  Top 10: SOCKET13.A1_6 SOCKET14.A2_1 | SOCKET14.A1_6 SOCKET15.A2_1 | SOCKET15.A1_6 SOCKET16.A2_1 | SOCKET16.A1_6 SOCKET17.A2_1 | SOCKET17.A1_6 SOCKET18.A2_1 | SOCKET18.A1_6 SOCKET19.A2_1 | SOCKET19.A1_6 SOCKET20.A2_1 | SOCKET20.A1_6 SOCKET21.A2_1 | SOCKET21.A1_6 SOCKET22.A2_1 | SOCKET22.A1_6 SOCKET23.A2_1 | SOCKET23.A1_6 SOCKET24.A2_1 | SOCKET24.A1_6 SOCKET25.A2_1 | SOCKET25.A1_6 SOCKET26.A2_1 | SOCKET26.A1_6 SOCKET00.A2_1 | SOCKET00.A1_6 SOCKET01.A2_1 | SOCKET01.A1_6 SOCKET02.A2_1 | SOCKET02.A1_6 SOCKET03.A2_1 | SOCKET03.A1_6 SOCKET04.A2_1 | SOCKET04.A1_6 SOCKET05.A2_1 | SOCKET05.A1_6 SOCKET06.A2_1 | SOCKET06.A1_6 SOCKET07.A2_1 | SOCKET07.A1_6 SOCKET08.A2_1 | SOCKET08.A1_6 SOCKET09.A2_1 | SOCKET09.A1_6 SOCKET10.A2_1 | SOCKET10.A1_6 SOCKET11.A2_1 | SOCKET11.A1_6 SOCKET12.A2_1 | SOCKET12.A1_6 SOCKET13.A2_1